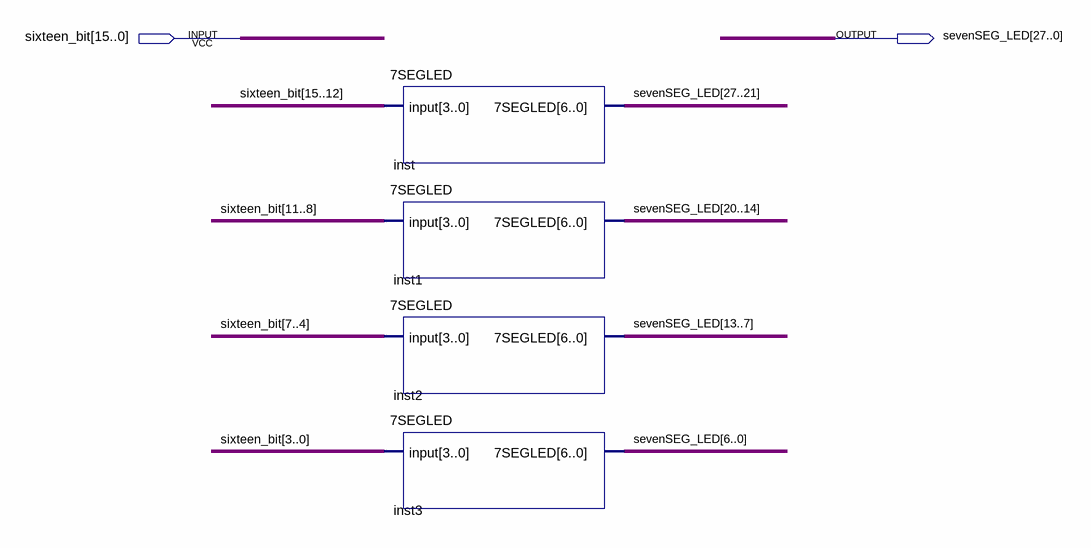
[diagram p0: schematic sheet]
// Quartus schematic sixteen_bit_to_sevenSEG_LED.bdf as structural Verilog: 4 symbols, 2 pins
module sixteen_bit_to_sevenSEG_LED (
  input  [15:0] sixteen_bit,
  output [27:0] sevenSEG_LED
);

  \7SEGLED  inst (.\input (sixteen_bit[15:12]), .\7SEGLED (sevenSEG_LED[27:21]));
  \7SEGLED  inst1 (.\input (sixteen_bit[11:8]), .\7SEGLED (sevenSEG_LED[20:14]));
  \7SEGLED  inst2 (.\input (sixteen_bit[7:4]), .\7SEGLED (sevenSEG_LED[13:7]));
  \7SEGLED  inst3 (.\input (sixteen_bit[3:0]), .\7SEGLED (sevenSEG_LED[6:0]));
endmodule
